# EAGLE design CANBUS_USB (EAGLE 9.1.3)
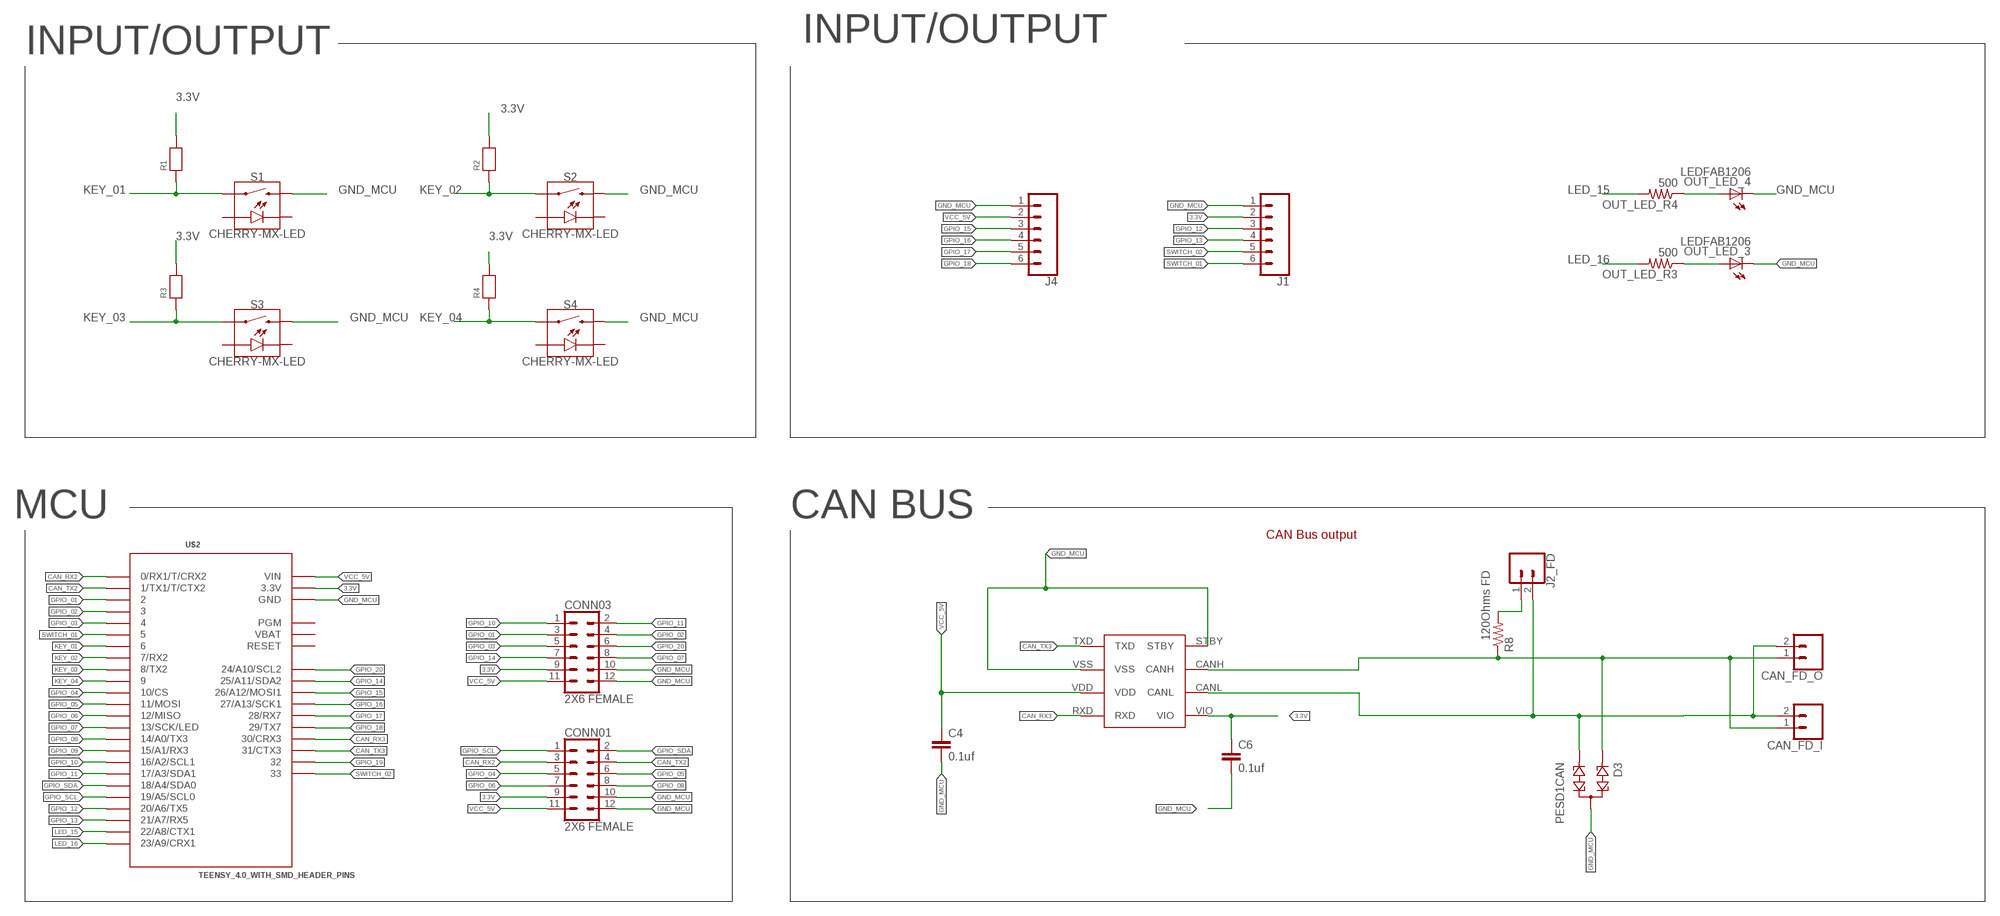
[diagram p0: schematic, sheet 1, part 1 of 2]
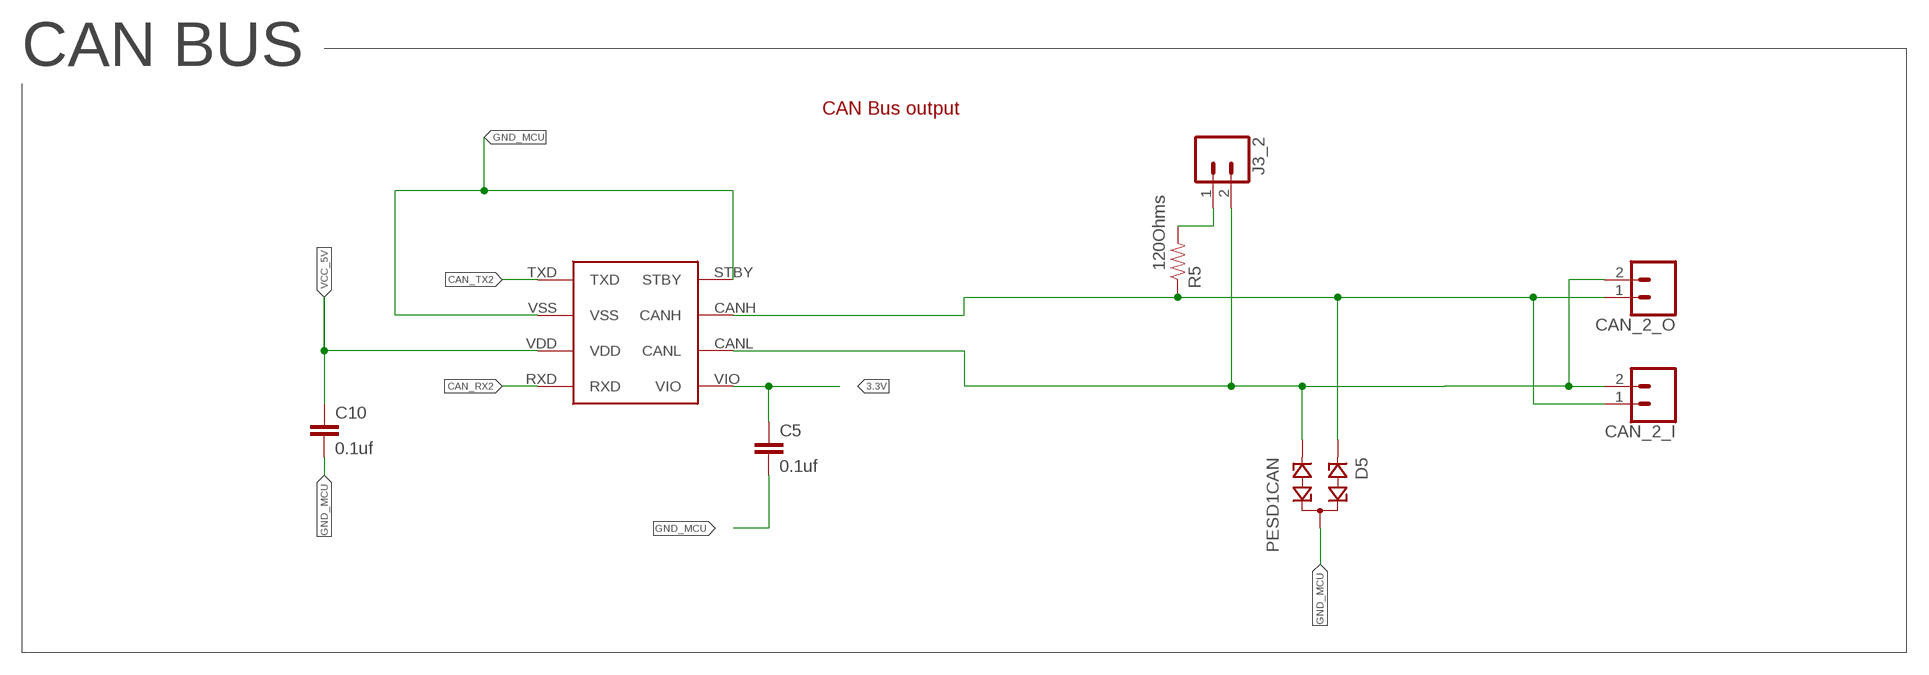
[diagram p1: schematic, sheet 1, part 2 of 2]

## Parts
C4  0.1uf  0.1UF-25V(+80/-20%)(0603)  [0603-CAP]
C5  0.1uf  0.1UF-25V(+80/-20%)(0603)  [0603-CAP]
C6  0.1uf  0.1UF-25V(+80/-20%)(0603)  [0603-CAP]
C10  0.1uf  0.1UF-25V(+80/-20%)(0603)  [0603-CAP]
CAN_2_I  CONN_02-JST-2MM-SMT  [JST-2-SMD]
CAN_2_O  CONN_02-JST-2MM-SMT  [JST-2-SMD]
CAN_FD_I  CONN_02-JST-2MM-SMT  [JST-2-SMD]
CAN_FD_O  CONN_02-JST-2MM-SMT  [JST-2-SMD]
CONN01  2X6 FEMALE  CONN_06X2PTH_FEMALE  [2X6]
CONN03  2X6 FEMALE  CONN_06X2PTH_FEMALE  [2X6]
D3  PESD1CAN  [SOT23]
D5  PESD1CAN  [SOT23]
J1  CONN_06SMD-1MM  [1X06-1MM]
J2_FD  CONN_02  [1X02]
J3_2  CONN_02  [1X02]
J4  CONN_06SMD-1MM  [1X06-1MM]
MCP2562  MCP2562  [MCP2562]
MCP2562FD  MCP2562  [MCP2562]
OUT_LED_3  LEDFAB1206  [LED1206FAB]
OUT_LED_4  LEDFAB1206  [LED1206FAB]
OUT_LED_R3  500  RES-US1206FAB  [R1206FAB]
OUT_LED_R4  500  RES-US1206FAB  [R1206FAB]
R1  RESISTOR1206  [1206]
R2  RESISTOR1206  [1206]
R3  RESISTOR1206  [1206]
R4  RESISTOR1206  [1206]
R5  120Ohms  10KOHM-1/10W-1%(0603)0603  [0603-RES]
R8  120Ohms FD  10KOHM-1/10W-1%(0603)0603  [0603-RES]
S1  CHERRY-MX-LED  [CHERRY-MX-LED]
S2  CHERRY-MX-LED  [CHERRY-MX-LED]
S3  CHERRY-MX-LED  [CHERRY-MX-LED]
S4  CHERRY-MX-LED  [CHERRY-MX-LED]
U$2  TEENSY_4.0_WITH_SMD_HEADER_PINS  [TEENSY_4.0_WITH_SMD_HEADER_PINS]

## Nets
3.3V: C5.1 C6.1 CONN01.9 CONN03.9 J1.2 MCP2562.VIO MCP2562FD.VIO R1.2 R2.2 R3.2 R4.2 U$2.3.3V U$2.3.3V1(3.3V)
CAN_H: CAN_FD_I.1 CAN_FD_O.1 D3.1 MCP2562FD.CANH R8.1
CAN_H1: CAN_2_I.1 CAN_2_O.1 D5.1 MCP2562.CANH R5.1
CAN_L: CAN_FD_I.2 CAN_FD_O.2 D3.2 J2_FD.2 MCP2562FD.CANL
CAN_L1: CAN_2_I.2 CAN_2_O.2 D5.2 J3_2.2 MCP2562.CANL
CAN_RX2: CONN01.3 MCP2562.RXD U$2.0(0/RX1/T/CRX2)
CAN_RX3: MCP2562FD.RXD U$2.30(30/CRX3)
CAN_TX2: CONN01.4 MCP2562.TXD U$2.1(1/TX1/T/CTX2)
CAN_TX3: MCP2562FD.TXD U$2.31(31/CTX3)
GND_MCU: C4.2 C5.2 C6.2 C10.2 CONN01.10 CONN01.12 CONN03.10 CONN03.12 D3.3 D5.3 J1.1 J4.1 MCP2562.STBY MCP2562.VSS MCP2562FD.STBY MCP2562FD.VSS OUT_LED_3.2(C) OUT_LED_4.2(C) S1.S2 S2.S2 S3.S2 S4.S2 U$2.GND U$2.GND1(GND) U$2.GND2(GND)
GPIO_01: CONN03.3 U$2.2
GPIO_02: CONN03.4 U$2.3
GPIO_03: CONN03.5 U$2.4
GPIO_04: CONN01.5 U$2.10(10/CS)
GPIO_05: CONN01.6 U$2.11(11/MOSI)
GPIO_06: CONN01.7 U$2.12(12/MISO)
GPIO_07: CONN03.8 U$2.13(13/SCK/LED)
GPIO_08: CONN01.8 U$2.14/A0(14/A0/TX3)
GPIO_09: U$2.15/A1(15/A1/RX3)
GPIO_10: CONN03.1 U$2.16/A2(16/A2/SCL1)
GPIO_11: CONN03.2 U$2.17/A3(17/A3/SDA1)
GPIO_12: J1.3 U$2.20/A6(20/A6/TX5)
GPIO_13: J1.4 U$2.21/A7(21/A7/RX5)
GPIO_14: CONN03.7 U$2.25(25/A11/SDA2)
GPIO_15: J4.3 U$2.26(26/A12/MOSI1)
GPIO_16: J4.4 U$2.27(27/A13/SCK1)
GPIO_17: J4.5 U$2.28(28/RX7)
GPIO_18: J4.6 U$2.29(29/TX7)
GPIO_19: U$2.32
GPIO_20: CONN03.6 U$2.24(24/A10/SCL2)
GPIO_SCL: CONN01.1 U$2.19/A5(19/A5/SCL0)
GPIO_SDA: CONN01.2 U$2.18/A4(18/A4/SDA0)
KEY_01: R1.1 S1.S1 U$2.6
KEY_02: R2.1 S2.S1 U$2.7(7/RX2)
KEY_03: R3.1 S3.S1 U$2.8(8/TX2)
KEY_04: R4.1 S4.S1 U$2.9
LED_15: OUT_LED_R4.2 U$2.22/A8(22/A8/CTX1)
LED_16: OUT_LED_R3.2 U$2.23/A9(23/A9/CRX1)
N$2: J2_FD.1 R8.2
N$5: J3_2.1 R5.2
N$6: OUT_LED_3.1(A) OUT_LED_R3.1
N$7: OUT_LED_4.1(A) OUT_LED_R4.1
SWITCH_01: J1.6 U$2.5
SWITCH_02: J1.5 U$2.33
VCC_5V [vcc5]: C4.1 C10.1 CONN01.11 CONN03.11 J4.2 MCP2562.VDD MCP2562FD.VDD U$2.VIN
Unconnected: S1.A S1.K(C) S2.A S2.K(C) S3.A S3.K(C) S4.A S4.K(C) U$2.PGM U$2.RESET

## Notes on the sheet
- INPUT/OUTPUT | INPUT/OUTPUT
- MCU | CAN BUS | CAN BUS
- CAN Bus output
- CAN Bus output

## Power pins joined to a net without a drawn wire
VBAT: U$2.VBAT

## Library data of the parts
C4-C6 C10 = SparkFun-Capacitors:0.1UF-25V(+80/-20%)(0603): CAP-00810 Ceramic Standard decoupling cap; PROD_ID: CAP-00810; VALUE: 0.1uF
CAN_2_I CAN_2_O CAN_FD_I CAN_FD_O = SparkFun-Connectors:CONN_02: Multi connection point. Often used as Generic Header-pin footprint for 0.1 inch spaced/style header connections On any of the 0.1 inch spaced packages, you can populate with these: Break Away Headers - Straight <https://www.sparkfun.com/products/116> (PRT-00116) Break Away Male Headers - Right Angle <https://www.sparkfun.com/products/553> (PRT-00553) Female Headers <https://www.sparkfun.com/products/115> (PRT-00115) Break Away Headers - Machine Pin <https://www.sparkfun.com/products/117> (PRT-00117) Break Away Female Headers - Swiss Machine Pin <https://www.sparkfun.com/products/743> (PRT-00743) For SCREWTERMINALS and SPRING TERMINALS visit here: Screw Terimnals on SparkFun.com <https://www.sparkfun.com/search/results?term=Screw+Terminals> (5mm/3.5mm/2.54mm spacing) This device is also useful as a general connection point to wire up your design to another part of your project. Our various solder wires solder well into these plated through hole pads. Hook-Up Wire - Assortment (Stranded, 22 AWG) <https://www.sparkfun.com/products/11375> (PRT-11375) Hook-Up Wire - Assortment (Solid Core, 22 AWG) <https://www.sparkfun.com/products/11367> (PRT-11367) View the entire wire category on our website here <https://www.sparkfun.com/categories/141> Special notes: Molex polarized connector foot print use with: PRT-08233 with associated crimp pins and housings. 2.54_SCREWTERM for use with PRT-10571. 3.5mm Screw Terminal footprints for PRT-08084 5mm Screw Terminal footprints for use with PRT-08432; PROD_ID: CONN-11443
CONN01 CONN03 = SparkFun-Connectors:CONN_06X2: Multi connection point. Often used as Generic Header-pin footprint for 0.1 inch spaced/style header connections On any of the 0.1 inch spaced packages, you can populate with these: Break Away Headers - Straight <https://www.sparkfun.com/products/116> (PRT-00116) Break Away Male Headers - Right Angle <https://www.sparkfun.com/products/553> (PRT-00553) Female Headers <https://www.sparkfun.com/products/115> (PRT-00115) Break Away Headers - Machine Pin <https://www.sparkfun.com/products/117> (PRT-00117) Break Away Female Headers - Swiss Machine Pin <https://www.sparkfun.com/products/743> (PRT-00743); PROD_ID: CONN-12423
D3 D5 = diode:PESD1CAN: CAN bus ESD protection diode Source: http://www.nxp.com/documents/data_sheet/PESD1CAN.pdf
J1 J4 = SparkFun-Connectors:CONN_06: Multi connection point. Often used as Generic Header-pin footprint for 0.1 inch spaced/style header connections On any of the 0.1 inch spaced packages, you can populate with these: Break Away Headers - Straight <https://www.sparkfun.com/products/116> (PRT-00116) Break Away Male Headers - Right Angle <https://www.sparkfun.com/products/553> (PRT-00553) Female Headers <https://www.sparkfun.com/products/115> (PRT-00115) Break Away Headers - Machine Pin <https://www.sparkfun.com/products/117> (PRT-00117) Break Away Female Headers - Swiss Machine Pin <https://www.sparkfun.com/products/743> (PRT-00743) Arduino Stackable Header - 6 Pin <https://www.sparkfun.com/products/9280> (PRT-09280) For SCREWTERMINALS and SPRING TERMINALS visit here: Screw Terimnals on SparkFun.com <https://www.sparkfun.com/search/results?term=Screw+Terminals> (5mm/3.5mm/2.54mm spacing) This device is also useful as a general connection point to wire up your design to another part of your project. Our various solder wires solder well into these plated through hole pads. Hook-Up Wire - Assortment (Stranded, 22 AWG) <https://www.sparkfun.com/products/11375> (PRT-11375) Hook-Up Wire - Assortment (Solid Core, 22 AWG) <https://www.sparkfun.com/products/11367> (PRT-11367) View the entire wire category on our website here <https://www.sparkfun.com/categories/141>; PROD_ID: CONN-08249; SF_ID: GPS-00579
J2_FD J3_2 = SparkFun-Connectors:CONN_02: Multi connection point. Often used as Generic Header-pin footprint for 0.1 inch spaced/style header connections On any of the 0.1 inch spaced packages, you can populate with these: Break Away Headers - Straight <https://www.sparkfun.com/products/116> (PRT-00116) Break Away Male Headers - Right Angle <https://www.sparkfun.com/products/553> (PRT-00553) Female Headers <https://www.sparkfun.com/products/115> (PRT-00115) Break Away Headers - Machine Pin <https://www.sparkfun.com/products/117> (PRT-00117) Break Away Female Headers - Swiss Machine Pin <https://www.sparkfun.com/products/743> (PRT-00743) For SCREWTERMINALS and SPRING TERMINALS visit here: Screw Terimnals on SparkFun.com <https://www.sparkfun.com/search/results?term=Screw+Terminals> (5mm/3.5mm/2.54mm spacing) This device is also useful as a general connection point to wire up your design to another part of your project. Our various solder wires solder well into these plated through hole pads. Hook-Up Wire - Assortment (Stranded, 22 AWG) <https://www.sparkfun.com/products/11375> (PRT-11375) Hook-Up Wire - Assortment (Solid Core, 22 AWG) <https://www.sparkfun.com/products/11367> (PRT-11367) View the entire wire category on our website here <https://www.sparkfun.com/categories/141> Special notes: Molex polarized connector foot print use with: PRT-08233 with associated crimp pins and housings. 2.54_SCREWTERM for use with PRT-10571. 3.5mm Screw Terminal footprints for PRT-08084 5mm Screw Terminal footprints for use with PRT-08432
MCP2562 MCP2562FD = MCP2562:MCP2562
OUT_LED_3 OUT_LED_4 = fab:LED: LED
OUT_LED_R3 OUT_LED_R4 = fab:RES-US: Resistor (US Symbol) Variants with postfix FAB are widened to allow the routing of internal traces
R1-R4 = microbuilder:RESISTOR: Resistors 0402 - 0402 Surface Mount Package 22 Ohm 1% 1/16W [Digikey: 311-22.0LRTR-ND] 33 Ohm 5% 1/16W 1.0K 5% 1/16W 1.5K 5% 1/16W 2.0K 1% 1/16W 10.0K 1% 1/16W [Digikey: 311-10.0KLRTR-ND] 10.0K 5% 1/16W [Digikey: RMCF0402JT10K0TR-ND] 12.1K 1% 1/16W [Digikey: 311-22.0LRTR-ND] 100.0K 5% 1/16W 0603 - 0603 Surface Mount Package 0 Ohm 1/10 Watt 1% Resistor 15 Ohm 1/10 Watt 1% Resistor 33 Ohm 1/10 Watt 1% Resistor 49.9 Ohm 1/10 Watt 1% Resistor 100 Ohm 1/10 Watt 1% Resistor 150 Ohm 1/10 Watt 1% Resistor 240 Ohm 1/10 Watt 1% Resistor 390 Ohm 1/10 Watt 1% Resistor 560 Ohm 1/10 Watt 1% Resistor 680 Ohm 1/10 Watt 1% Resistor 750 Ohm 1/10 Watt 1% Resistor 1.0K Ohm 1/10 Watt 1% Resistor 1.5K Ohm 1/10 Watt 1% Resistor 2.0K Ohm 1/10 Watt 1% Resistor 2.2K Ohm 1/10 Watt 1% Resistor 3.3K Ohm 1/10 Watt 1% Resistor 4.7K Ohm 1/10 Watt 1% Resistor 10.0K Ohm 1/10 Watt 1% Resistor 12.0K Ohm 1/10 Watt 1% Resistor 12.1K Ohm 1/10 Watt 1% Resistor 20.0K Ohm 1/10 Watt 1% Resistor 33.0K Ohm 1/10 Watt 1% Resistor 100.0K Ohm 1/10 Watt 1% Resistor 0805 - 0805 Surface Mount Package 0 Ohm 1/8 Watt 1% Resistor 33 Ohm 1/8 Watt 1% Resistor 100 Ohm 1/8 Watt 1% Resistor 150 Ohm 1/8 Watt 1% Resistor 200 Ohm 1/8 Watt 1% Resistor 240 Ohm 1/8 Watt 1% Resistor 330 Ohm 1/8 Watt 1% Resistor 390 Ohm 1/8 Watt 1% Resistor 470 Ohm 1/8 Watt 1% Resistor 1.0K Ohm 1/8 Watt 1% Resistor 1.5K Ohm 1/8 Watt 1% Resistor 2.0K Ohm 1/8 Watt 1% Resistor 4.7K Ohm 1/8 Watt 1% Resistor 5.1K Ohm 1/8 Watt 1% Resistor 5.6K Ohm 1/8 Watt 1% Resistor 10.0K Ohm 1/8 Watt 1% Resistor 22.0K Ohm 1/8 Watt 1% Resistor 33.0K Ohm 1/8 Watt 1% Resistor 100K Ohm 1/8 Watt 1% Resistor 1206 - 1206 Surface Mount Package 2012 - 2010 Surface Mount Package 0.11 Ohm 1/2 Watt 1% Resistor - Digikey: RHM.11UCT-ND
R5 R8 = SparkFun-Resistors:10KOHM-1/10W-1%(0603): RES-00824; PROD_ID: RES-00824; VALUE: 10K
S1-S4 = cherry-temp:CHERRY-MX-LED
U$2 = Teensy4:TEENSY_4.0_WITH_SMD_HEADER_PINS: Footprint for Teensy 3.1 or 3.2 board using all pin connections on the outer perimeter

## Net classes
0 default: width 0.2 mm, clearance 0.2 mm
1 gnd: width 0.2 mm, clearance 0.2 mm
3 vcc: width 0.35 mm, clearance 0.2 mm
4 vcc5: width 0.35 mm, clearance 0.2 mm

## Board
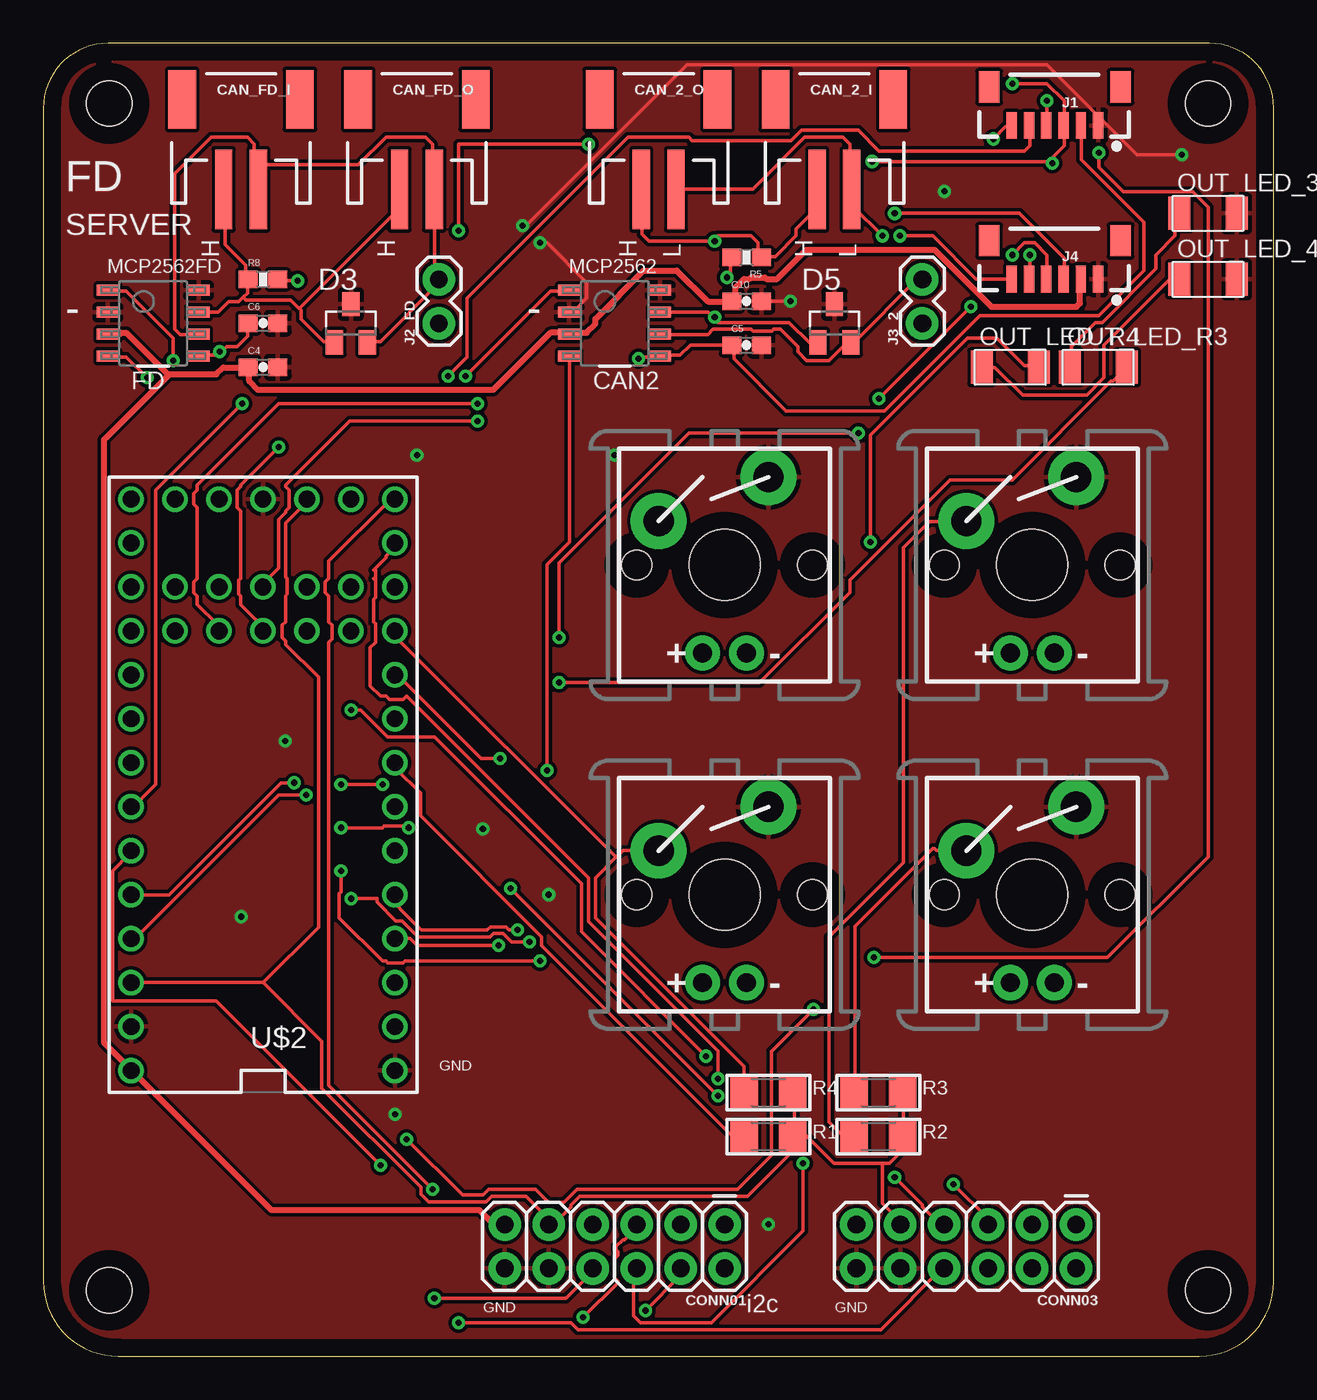
[diagram p2: board, top side]
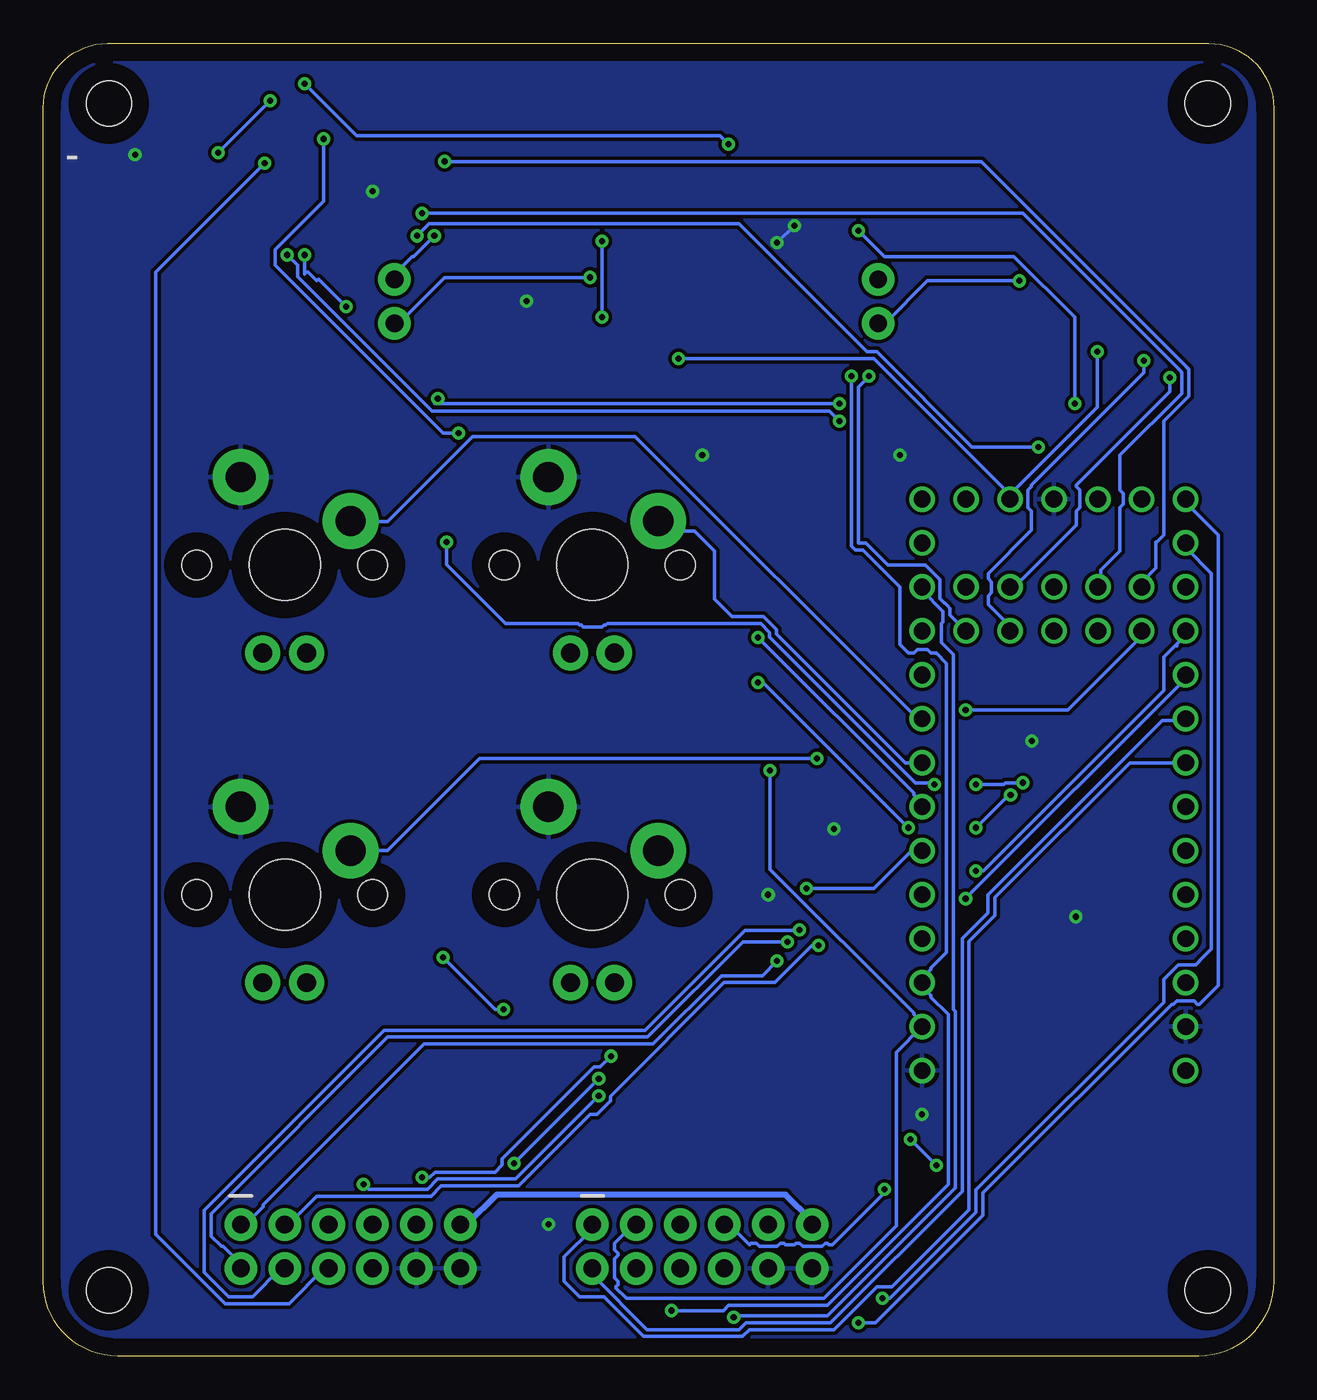
[diagram p3: board, bottom side, seen from below]

Size 71.1 x 75.87 mm. Coordinates in mm from the lower left corner, seen from the top.
Outline: 0,72.12 0,4.34 arc90 4.34,0 66.8,0 arc90 71.1,4.3 71.1,72.15 arc90 67.38,75.87 3.75,75.87 arc90 0,72.12
Copper layers (1*16): Top 0.035mm / dielectric 1.5mm / Bottom 0.035mm
Design rules "default": minimum track width 6mil, minimum drill 0.35mm, track to track 6mil, track to pad 6mil, pad to pad 6mil, via to via 6mil, smd to smd 6mil, copper to edge 40mil, drill to drill 6mil, minimum pad ring 10mil, minimum via ring 8mil, stop-mask expansion 4mil, vias tented up to drill 0mil, thermal gap 10mil
Holes 2.6 mm at 3.81,72.39 67.31,72.39 3.81,3.81 67.31,3.81

### Footprints (pad centres in the part's own frame; a part is rotated, then mirrored left to right if it is on the bottom)
0603-CAP = smd 1.1 x 1: 1 -0.85,0; 2 0.85,0
JST-2-SMD = smd 1 x 4.6: 1 -1,-3.7; 2 1,-3.7 | smd 1.6 x 3.4: NC1 -3.4,1.5; NC2 3.4,1.5
2X6 = drill 1.016 pad 1.88: 1 0,0; 2 0,2.54; 3 2.54,0; 4 2.54,2.54; 5 5.08,0; 6 5.08,2.54; 7 7.62,0; 8 7.62,2.54; 9 10.16,0; 10 10.16,2.54; 11 12.7,0; 12 12.7,2.54
SOT23 = smd 1 x 1.4: 1 -0.95,-1.1; 2 0.95,-1.1; 3 0,1.1
1X06-1MM = smd 0.6 x 1.55: 1 -2.54,1.27; 2 -1.54,1.27; 3 -0.54,1.27; 4 0.46,1.27; 5 1.46,1.27; 6 2.46,1.27 | smd 1.2 x 1.8: P$1 -3.84,-0.955; P$2 3.76,-0.955
1X02 = drill 1.016 pad 1.88: 1 0,0; 2 2.54,0
MCP2562 = smd 1.27 x 0.635: CANH 2.625,0.635; CANL 2.625,-0.635; RXD -2.625,-1.905; STBY 2.625,1.905; TXD -2.625,1.905; VDD -2.625,-0.635; VIO 2.625,-1.905; VSS -2.625,0.635
LED1206FAB = smd 1.27 x 1.905: 1 -1.651,0; 2 1.651,0
R1206FAB = smd 1.27 x 1.905: 1 -1.651,0; 2 1.651,0
1206 = smd 1.6 x 1.8: 1 -1.4,0; 2 1.4,0
0603-RES = smd 1.1 x 1: 1 -0.85,0; 2 0.85,0
CHERRY-MX-LED = drill 1.092 pad 2.032: A -1.27,-5.08; K 1.27,-5.08 | drill 1.753 pad 3.226: S1 -3.81,2.54; S2 2.54,5.08 | hole 4.089: 0,0 | hole 1.707: -5.08,0; 5.08,0
TEENSY_4.0_WITH_SMD_HEADER_PINS = drill 0.965: 0 -7.62,13.97; 1 -7.62,11.43; 2 -7.62,8.89; 3 -7.62,6.35; 3.3V 7.62,11.43; 3.3V1 -2.54,-16.51; 4 -7.62,3.81; 5 -7.62,1.27; 6 -7.62,-1.27; 7 -7.62,-3.81; 8 -7.62,-6.35; 9 -7.62,-8.89; 10 -7.62,-11.43; 11 -7.62,-13.97; 12 -7.62,-16.51; 13 7.62,-16.51; 14/A0 7.62,-13.97; 15/A1 7.62,-11.43; 16/A2 7.62,-8.89; 17/A3 7.62,-6.35; 18/A4 7.62,-3.81; 19/A5 7.62,-1.27; 20/A6 7.62,1.27; 21/A7 7.62,3.81; 22/A8 7.62,6.35; 23/A9 7.62,8.89; 24 5.08,-11.43; 25 5.08,-8.89; 26 2.54,-11.43; 27 2.54,-8.89; 28 0,-11.43; 29 0,-8.89; 30 -2.54,-11.43; 31 -2.54,-8.89; 32 -5.08,-11.43; 33 -5.08,-8.89; GND -7.62,16.51; GND1 0,-16.51; GND2 7.62,13.97; PGM 2.54,-16.51; RESET 5.08,-16.51; VBAT -5.08,-16.51; VIN 7.62,16.51

### Placement (x,y rotation side)
C4  12.7,57.15 0 top
C5  40.64,58.42 0 top
C6  12.7,59.69 0 top
C10  40.64,60.96 0 top
CAN_2_I  45.72,71.12 0 top
CAN_2_O  35.56,71.12 0 top
CAN_FD_I  11.43,71.12 0 top
CAN_FD_O  21.59,71.12 0 top
CONN01  39.37,7.62 180 top
CONN03  59.69,7.62 180 top
D3  17.78,59.69 0 top
D5  45.72,59.69 0 top
J1  58.42,72.39 180 top
J2_FD  22.86,59.69 90 top
J3_2  50.8,59.69 90 top
J4  58.42,63.5 180 top
MCP2562  33.02,59.69 0 top
MCP2562FD  6.35,59.69 0 top
OUT_LED_3  67.31,66.04 0 top
OUT_LED_4  67.31,62.23 0 top
OUT_LED_R3  60.96,57.15 0 top
OUT_LED_R4  55.88,57.15 0 top
R1  41.91,12.7 0 top
R2  48.26,12.7 0 top
R3  48.26,15.24 0 top
R4  41.91,15.24 0 top
R5  40.64,63.5 180 top
R8  12.7,62.23 0 top
S1  39.37,45.72 0 top
S2  57.15,45.72 0 top
S3  57.15,26.67 0 top
S4  39.37,26.67 0 top
U$2  12.7,33.02 180 top

### Tracks (layer width: path | path; a pad name or v marks a point on that pad's centre or on a via)
3.3V  (via drill 0.35)
  Top 0.2: R1.2 43.4,12.74 43.4,15.24 R4.2 | R3.2 49.7,15.24 49.7,12.74 R2.2 49.6,12.64 49.6,11.84 48.9,11.14 48.5,11.14 | 48.5,11.14 45.7,11.14 44.1,12.74 43.5,12.74 R1.2 | 48.5,11.14 48.5,8.84 49.5,7.84 49.5,7.64 CONN03.9 | 5.4,21.54 5.1,21.54 U$2.3.3V | R1.2 43.3,12.64 43.3,11.84 40.7,9.24 31,9.24 30.5,8.74 30.5,8.64 29.9,8.04 29.2,8.04 CONN01.9 29.2,7.64 29.2,7.94 27.9,9.24 25.9,9.24 25.57,8.91 22.27,8.91 21.82,9.36 21.82,9.75 16.1,15.47 16.1,18.19 12.7,21.59 | 10.25,57.99 10.1,57.84 9,57.84 MCP2562FD.VIO | 10.25,57.99 10.6,58.34 11.2,58.34 11.8,58.94 11.8,59.64 C6.1 | v10.2,58.04 10.25,57.99 | J1.2 60,71.04 60,69.14 63.6,65.54 63.6,62.74 61,60.14 54.13,60.14 48.6,54.61 42.93,54.61 39.9,57.64 39.9,58.24 39.8,58.34 C5.1 39.7,58.44 37.4,58.44 36.8,57.84 35.7,57.84 MCP2562.VIO 35.6,57.74 34.5,57.74 v34.4,57.64 | 5.5,21.74 5.5,21.54 U$2.3.3V | 15.9,32.14 15.9,39.24 14,41.14 14,41.34 13.8,41.54 13.8,42.24 14,42.44 14,43.94 14.1,44.04 14.1,44.94 14,45.04 14,48.14 15.3,49.44 U$2.3.3V1 | U$2.3.3V 12.7,21.59 | 15.9,32.14 | 15.9,32.14 15.9,24.79 12.7,21.59
  Bottom 0.2: v10.2,58.04 10.2,54.84 15.2,49.84 15.2,49.54 U$2.3.3V1 15.2,49.94 15.4,49.94 23.1,57.64 v34.4,57.64
CAN_H
  Top 0.2: 11.55,61.19 11.3,60.94 10.7,60.94 10.1,60.34 9,60.34 MCP2562FD.CANH | 11.55,61.19 11.8,61.44 11.8,62.14 R8.1 11.7,62.14 11.7,63.04 10.5,64.24 10.5,67.34 CAN_FD_I.1 | 14.8,60.54 14.3,61.04 11.7,61.04 11.6,61.14 11.55,61.19 | 14.8,60.54 14.9,60.44 14.9,59.94 16.2,58.64 16.8,58.64 D3.1 | 14.8,60.54 20.5,66.24 20.5,67.34 CAN_FD_O.1
CAN_H1  (via drill 0.35)
  Top 0.2: 38.75,59.99 39,59.74 43.1,59.74 44.3,58.54 44.7,58.54 D5.1 | 38.75,59.99 38.4,60.34 35.7,60.34 MCP2562.CANH | CAN_2_I.1 44.7,67.34 44.7,66.34 43.5,65.14 43.5,64.74 42.3,63.54 41.5,63.54 R5.1 41.5,63.64 41.3,63.84 41.3,64.34 40.9,64.74 39,64.74 38.75,64.49 | 38.75,64.49 38.7,64.44 35,64.44 34.6,64.84 34.6,67.34 CAN_2_O.1 | v38.8,60.04 38.75,59.99 | v38.8,64.44 38.75,64.49
  Bottom 0.2: v38.8,64.44 v38.8,60.04
CAN_L
  Top 0.2: 12.2,68.84 12.2,67.64 12.4,67.44 CAN_FD_I.2 12.2,68.84 | 12.2,68.84 12.2,70.04 11.8,70.44 9.7,70.44 7.6,68.34 7.6,59.34 7.9,59.04 8.9,59.04 MCP2562FD.CANL | D3.2 18.8,58.64 19.5,58.64 22.8,61.94 22.8,62.14 J2_FD.2 22.8,62.24 22.8,62.94 22.6,63.14 22.6,67.34 CAN_FD_O.2 22.5,67.44 22.5,70.04 22.1,70.44 19.8,70.44 18.2,68.84 12.2,68.84
CAN_L1  (via drill 0.35)
  Top 0.2: CAN_2_O.2 36.6,67.44 41,67.44 44,70.44 46.2,70.44 46.6,70.04 46.6,67.54 46.7,67.44 CAN_2_I.2 46.8,67.34 46.8,66.44 v48.5,64.74 | MCP2562.CANL 35.7,59.04 38.4,59.04 38.7,59.34 40.9,59.34 41,59.24 42.1,59.24 42.2,59.34 42.6,59.34 43.6,58.34 43.6,58.04 44.1,57.54 45.4,57.54 46.4,58.54 46.6,58.54 D5.2 46.7,58.64 46.9,58.64 50.4,62.14 50.8,62.14 J3_2.2
  Bottom 0.2: v48.5,64.74 49.7,63.54 49.8,63.54 50.8,62.54 J3_2.2
CAN_RX2  (via drill 0.35)
  Top 0.2: v29.1,33.84 29.1,45.74 30.4,47.04 30.4,57.74 MCP2562.RXD
  Bottom 0.2: v29.1,33.84 29.1,28.14 20.8,19.84 20.8,19.74 20.4,19.34 20.4,19.14 U$2.0 | 20.4,18.74 20.4,19.04 U$2.0 | CONN01.3 36.9,7.54 37.1,7.54 38.1,6.54 38.1,6.14 37.9,5.94 37.9,5.84 38.1,5.64 38.1,4.54 37.9,4.34 37.9,4.14 38,4.04 38,3.94 37.4,3.34 26,3.34 21.8,7.54 21.8,17.57 U$2.0
CAN_RX3  (via drill 0.35)
  Top 0.2: v6,56.54 4.8,57.74 3.8,57.74 MCP2562FD.RXD
  Bottom 0.2: v6,56.54 6,55.74 11.4,50.34 11.4,50.24 11.2,50.04 11.2,49.04 11.4,48.84 11.4,48.04 14.9,44.54 15.2,44.54 U$2.30
CAN_TX2  (via drill 0.35)
  Top 0.2: v24.4,56.64 29.3,61.54 30.3,61.54 MCP2562.TXD | v34.8,2.64 36.8,4.64 36.8,5.04 CONN01.4
  Bottom 0.2: v34.8,2.64 31.8,2.64 31.5,2.94 25.8,2.94 18.8,9.94 18.8,19.74 19.8,20.74 19.8,20.84 20.3,21.34 20.3,21.54 U$2.1 20.3,21.64 20.3,21.84 19.8,22.34 19.8,22.44 18.9,23.34 18.9,40.04 19.5,40.64 19.8,40.64 20,40.84 20.6,40.84 20.8,40.64 21.1,40.64 21.59,41.13 21.59,44.45 23.73,46.59 24.17,46.59 24.4,46.82 v24.4,56.64
CAN_TX3  (via drill 0.35)
  Top 0.2: v7.5,57.54 7.5,58.84 4.8,61.54 3.8,61.54 MCP2562FD.TXD
  Bottom 0.2: v7.5,57.54 7.5,56.84 14,50.34 14,50.24 14.2,50.04 14.2,49.04 14,48.84 14,47.74 16.5,45.24 16.5,44.94 16.3,44.74 16.3,44.14 16.5,43.94 16.5,43.44 15.3,42.24 15.3,41.94 U$2.31
GND_MCU  (via drill 0.35)
  Top 0.2: v65.8,69.44 63.2,69.44 58,74.64 37.2,74.64 27.9,65.34 v27.7,65.34 | v28.7,64.34 29.1,64.34 31.4,62.04 31.4,61.14 30.6,60.34 30.4,60.34 MCP2562.VSS | 61,62.24 J4.1 61,62.24 | 61,62.24 61.03,62.24 61,62.24 | C10.2 v43.18,60.96
  Bottom 0.2: v28.7,64.34 v27.7,65.34
  other vias: 11.43,25.4 13.97,35.56 29.21,26.67 21.59,52.07 25.4,30.48 52.07,67.31 33.02,52.07 20.32,13.97 41.91,7.62
  pour Top: -58.42,80.01 119.38,80.01 119.38,-6.35 -58.42,-6.35
  pour Bottom: -43.92,83.82 132.61,83.82 132.61,-92.71 arc-90
GPIO_01  (via drill 0.35)
  Top 0.2: v26.3,23.74 21.6,23.74 21.2,24.14 20.4,24.14 U$2.2
  Bottom 0.2: v26.3,23.74 26.67,23.74 28.82,21.59 31.75,21.59 38.32,15.02 38.32,14.76 39.11,13.97 39.5,13.97 43.63,9.84 48.1,9.84 48.7,9.24 55.3,9.24 56.9,7.64 57.1,7.64 CONN03.3
GPIO_02  (via drill 0.35)
  Top 0.2: 20.4,26.64 U$2.3 20.32,26.15 20.91,25.57 21.76,24.72 21.76,24.71 21.85,24.62 25.66,24.62 25.85,24.82 26.75,24.82 26.93,24.64 v27.4,24.64
  Bottom 0.2: CONN03.4 57.2,5.04 57.4,5.04 59,3.44 60.4,3.44 61.8,4.84 61.8,8.44 51.4,18.84 36.34,18.84 30.56,24.62 27.42,24.62 v27.4,24.64
GPIO_03  (via drill 0.35)
  Top 0.2: v39,15.04 v27,27.04 | v52.6,9.94 54.6,7.94 54.6,7.64 CONN03.5
  Bottom 0.2: v27,27.04 23.1,27.04 21,29.14 20.4,29.14 U$2.4 | v39,15.04 43.8,10.24 48.3,10.24 48.9,9.64 52.3,9.64 v52.6,9.94
GPIO_04  (via drill 0.35)
  Top 0.2: v31.2,2.24 33.2,4.24 33.2,4.34 33,4.54 33,5.64 33.2,5.84 33.2,6.04 33.1,6.14 33.1,6.34 33.5,6.74 33.6,6.74 34.2,7.34 34.2,7.54 CONN01.5
  Bottom 0.2: v31.2,2.24 31.1,2.34 25.8,2.34 18.4,9.74 18.4,19.94 18.5,20.04 18.5,40.54 19.2,41.24 19.2,42.34 19.1,42.44 19.1,43.04 20.3,44.24 20.3,44.44 U$2.10
GPIO_05  (via drill 0.35)
  Top 0.2: 19.1,45.44 19.15,45.49 | 19.15,45.49 19.8,46.14 19.8,46.24 20.3,46.74 20.3,46.94 U$2.11 | 19.15,44.89 19.2,44.84 19.2,43.84 19.1,43.74 19.1,42.44 19.2,42.34 19.2,41.24 18.9,40.94 18.9,38.74 19.5,38.14 19.8,38.14 20,37.94 20.8,37.94 21,38.14 31.5,27.64 31.5,25.14 39,17.64 v39,16.04 | 19.15,44.89 19.1,44.94 | v43.9,11.14 43.9,7.24 38.6,1.94 34.5,1.94 34.1,2.34 34.1,4.14 34.2,4.24 34.2,5.04 CONN01.6 | 19.15,45.49 19.2,45.44 19.2,44.94 19.15,44.89
  Bottom 0.2: v43.9,11.14 v39,16.04
GPIO_06  (via drill 0.35)
  Top 0.2: v22.5,9.64 16.5,15.64 16.5,41.24 16.7,41.44 16.7,42.24 16.5,42.44 16.5,43.94 16.3,44.14 16.3,44.74 16.5,44.94 16.5,45.94 20,49.44 20.3,49.44 U$2.12
  Bottom 0.2: v22.5,9.64 22.5,9.44 25.5,6.44 25.7,6.44 25.8,6.54 25.9,6.54 26.1,6.34 27.2,6.34 27.4,6.54 27.6,6.54 27.7,6.44 28.2,6.44 28.3,6.54 28.5,6.54 28.7,6.34 29.7,6.34 29.9,6.54 30.2,6.54 30.3,6.44 31.4,7.54 31.7,7.54 CONN01.7
GPIO_07  (via drill 0.35)
  Top 0.2: v24,1.94 30.5,1.94 30.9,1.54 48.4,1.54 52,5.14 CONN03.8
  Bottom 0.2: v24,1.94 23,1.94 16.8,8.14 16.8,9.44 5.9,20.34 5.8,20.34 5.6,20.54 4.6,20.54 4.4,20.34 4.3,20.34 3.2,21.44 3.2,47.44 5,49.24 5,49.44 U$2.13
GPIO_08  (via drill 0.35)
  Top 0.2: v22.6,3.34 30.2,3.34 31.7,4.84 31.7,5.04 CONN01.8
  Bottom 0.2: 4.3,22.84 4.04,23.09 | 4.04,23.09 3.6,23.54 3.6,45.24 5,46.64 5,46.94 U$2.14/A0 | 4.04,23.09 4.51,22.63 5.51,22.63 6.35,21.79 6.35,20.46 17.2,9.61 17.2,8.31 22.17,3.34 v22.6,3.34
GPIO_10  (via drill 0.35)
  Top 0.2: v17.2,28.04 17.2,26.84 17.1,26.74 17.1,25.34 19.6,22.84 19.8,22.84 19.9,22.74 20.8,22.74 20.9,22.84 v28.7,22.84
  Bottom 0.2: 5.59,41.15 5.6,41.14 5.6,41.04 | 5.59,41.15 5.1,41.64 5.1,41.84 U$2.16/A2 | 38.1,18.04 49.1,18.04 58.4,8.74 58.4,8.64 59.4,7.64 59.6,7.64 CONN03.1 | 38.1,18.04 38,18.04 | 5.59,41.15 6.35,40.39 6.35,38.46 16.77,28.04 v17.2,28.04 | 38.1,18.04 35.87,18.04 31.92,21.99 29.55,21.99 v28.7,22.84
GPIO_11  (via drill 0.35)
  Top 0.2: v17.8,26.44 19.28,26.44 19.28,26.24 20.36,25.17 20.75,25.17 21.36,24.56 21.36,24.55 21.68,24.22 25.82,24.22 26.02,24.42 26.58,24.42 27.06,23.94 v28.1,23.94
  Bottom 0.2: v17.8,26.44 5.1,39.14 5.1,39.34 U$2.17/A3 | CONN03.2 59.7,5.14 59.7,5.34 60.7,6.34 60.8,6.34 61.4,6.94 61.4,8.24 51.2,18.44 36.17,18.44 30.67,23.94 v28.1,23.94
GPIO_12  (via drill 0.35)
  Top 0.2: v56,73.54 58,73.54 59,72.54 59,71.54 J1.3 | v31.5,70.04 24,70.04 v24,65.04 | v11.5,55.04 6.5,50.04 6.5,33.04 5.5,32.04 U$2.20/A6
  Bottom 0.2: v56,73.54 53,70.54 32,70.54 v31.5,70.04 | v24,65.04 22.5,63.54 15,63.54 11.5,60.04 v11.5,55.04
GPIO_13  (via drill 0.35)
  Top 0.2: v58,72.54 58,71.54 J1.4 | v48,23.04 61.5,23.04 67.31,28.85 67.31,66.4 66.42,67.29 62.41,67.29 61,68.71 v61,69.54 | v44.5,20.04 42.08,17.61 42.08,11.59 40.12,9.64 30.83,9.64 30.08,8.89 29.21,8.89 28.46,9.64 25.73,9.64 25.41,9.32 24.23,9.32 v21,12.54 | v19.5,11.04 10,20.54 4,20.54 4,28.04 5,29.04 U$2.21/A7
  Bottom 0.2: v61,69.54 v58,72.54 | v48,23.04 45,20.04 v44.5,20.04 | v19.5,11.04 v21,12.54
GPIO_14  (via drill 0.35)
  Top 0.2: 31.1,25.4 31.1,24.54 v38.3,17.34 | 31.1,25.4 31.1,25.54 | v49.2,10.34 50.8,8.74 50.8,8.64 51.8,7.64 52,7.64 CONN03.7 | v17.8,37.34 18.34,37.34 19.89,35.79 22.63,35.79 31.1,27.32 31.1,25.4
  Bottom 0.2: v17.8,37.34 11.9,37.34 7.7,41.54 7.7,41.84 U$2.25 | v49.2,10.34 48.77,10.34 48.47,10.64 45,10.64 44.58,11.06 44.58,11.42 39.28,16.72 38.92,16.72 v38.3,17.34
GPIO_15  (via drill 0.35)
  Top 0.2: v49.2,66.04 56.4,66.04 59,63.44 59,62.24 J4.3
  Bottom 0.2: v49.2,66.04 14.5,66.04 5.34,56.88 | 5.3,56.84 5.34,56.88 | U$2.26 10.1,44.54 10,44.64 10,45.44 8.9,46.54 8.9,49.04 8.7,49.24 8.7,49.84 8.9,50.04 8.9,52.06 5.32,55.64 5.32,56.82 5.34,56.84 | 5.34,56.88 5.34,56.84 | 5.34,56.84 5.3,56.8 | 5.34,56.88 5.34,56.84
GPIO_16  (via drill 0.35)
  Top 0.2: v56,63.64 56.7,64.34 57.3,64.34 58,63.64 58,62.24 J4.4 | v25.1,55.04 13.6,55.04 8.9,50.34 8.9,50.04 8.7,49.84 8.7,49.24 8.9,49.04 8.9,44.94 8.7,44.74 8.7,44.14 8.9,43.94 8.9,43.44 10.1,42.24 10.1,41.94 U$2.27 | v48.3,55.34 v53.6,60.64
  Bottom 0.2: 56,62.54 56,62.64 | 56,62.64 v56,63.64 | v25.1,55.04 48.3,55.04 | 48.3,55.04 48.5,55.04 | 56,62.64 55.8,62.64 55.3,62.14 55.2,62.24 v53.6,60.64 | 48.3,55.04 v48.3,55.34
GPIO_17  (via drill 0.35)
  Top 0.2: v57,63.64 57,62.24 J4.5 | v25.1,54.04 17.7,54.04 14,50.34 14,50.24 14.2,50.04 14.2,49.04 14,48.84 14,48.74 13.6,48.34 13.6,45.54 12.7,44.64 12.7,44.54 U$2.28
  Bottom 0.2: v25.1,54.04 25.67,54.61 48.64,54.61 56.4,62.37 56.4,63.04 v57,63.64
GPIO_18  (via drill 0.35)
  Top 0.2: v49.5,64.74 51.4,64.74 53.9,62.24 55.9,62.24 J4.6 | v13.6,52.54 11.4,50.34 11.4,50.24 11.2,50.04 11.2,49.04 11.4,48.84 11.4,44.94 11.3,44.84 11.3,44.04 11.4,43.94 11.4,43.44 12.7,42.14 12.7,41.94 U$2.29
  Bottom 0.2: v49.5,64.74 48.8,65.44 30.9,65.44 30.36,64.89 23.5,58.04 22.93,58.04 17.43,52.54 v13.6,52.54
GPIO_20  (via drill 0.35)
  Top 0.2: 59,71.04 59,69.94 58.15,69.09 | 58.15,69.09 58.1,69.04 v47.9,69.04 | v58.3,68.94 58.2,69.04 58.15,69.09
  Bottom 0.2: v47.9,69.04 16.9,69.04 5.04,57.19 | 4.9,57.04 5.04,57.19 | 6.8,46.99 6.8,45.54 7.6,44.74 7.6,44.54 U$2.24 | 6.8,46.99 6.8,47.04 | v58.3,68.94 64.6,62.64 64.6,7.04 60.6,3.04 56.9,3.04 54.9,5.04 54.7,5.04 CONN03.6 | 5.04,57.19 5.04,57.15 4.9,57.01 4.9,55.49 6.35,54.04 6.35,49.53 | 6.35,49.53 6.35,48.89 | 6.35,49.53 6.35,47.44 6.8,46.99
GPIO_SCL
  Bottom 0.2: 5.1,34.24 U$2.19/A5 8.32,34.29 16.11,26.5 16.11,25.46 17.6,23.97 17.6,8.47 22.05,4.02 22.92,4.02 25.4,1.54 30.3,1.54 30.7,1.14 36.4,1.14 38.7,3.44 40.1,3.44 41,4.34 41,5.74 39.4,7.34 39.4,7.54 CONN01.1
GPIO_SDA
  Bottom 0.2: U$2.18/A4 5.1,36.74 6.44,36.74 16.51,26.67 16.51,25.63 18,24.14 18,9.54 25.6,1.94 30.5,1.94 30.9,1.54 36.2,1.54 39.3,4.64 39.3,5.04 CONN01.2
KEY_01
  Top 0.2: R1.1 40.5,12.74 39.8,12.74 28.8,23.74 28.8,24.24 21.8,31.24 21.8,32.54 20.4,33.94 20.4,34.24 U$2.6
  Bottom 0.2: 35.5,48.24 S1.S1 34.99,47.69 33.47,47.69 32.32,46.54 32.32,43.75 31.31,42.74 29.48,42.74 28.72,41.99 28.72,41.73 21.28,34.29 U$2.6
KEY_02
  Top 0.2: R2.1 46.8,12.74 46.2,12.74 45.4,13.54 45.4,24.24 49.7,28.54 49.7,46.74 51.2,48.24 53.3,48.24 S2.S1
  Bottom 0.2: U$2.7 20.4,36.84 20.6,36.84 36.9,53.14 46.3,53.14 51.2,48.24 53.3,48.24 S2.S1
KEY_03  (via drill 0.35)
  Top 0.2: R3.1 46.9,15.24 46.9,24.84 51.4,29.34 51.5,29.34 51.6,29.24 53.3,29.24 S3.S1 | v26.4,34.54 25.3,34.54 20.8,39.04 20.7,39.04 20.4,39.34 U$2.8
  Bottom 0.2: v26.4,34.54 45.9,34.54 51.2,29.24 53.3,29.24 S3.S1
KEY_04
  Top 0.2: 33.1,28.84 33.5,29.24 35.5,29.24 S4.S1 | 33.1,28.84 31.9,27.64 31.9,25.34 40.5,16.74 R4.1 | 33.1,28.84 20.4,41.54 20.4,41.84 U$2.9
LED_15  (via drill 0.35)
  Top 0.2: v47.8,47.04 47.8,53.24 53.4,58.84 55.1,58.84 56.7,57.24 57.5,57.24 OUT_LED_R4.2 | v17.2,33.04 v19.6,33.04 | 5.4,26.74 5.1,26.74 U$2.22/A8 7.26,26.67 13.73,33.14 v14.5,33.14
  Bottom 0.2: v47.8,47.04 47.8,45.74 44.4,42.34 40.2,42.34 40.1,42.24 40,42.24 39.9,42.14 38.8,42.14 38.7,42.24 38.6,42.24 38.5,42.34 29.64,42.34 29.12,41.82 29.12,41.56 20.7,33.14 19.9,33.14 19.8,33.04 v19.6,33.04 | v17.2,33.04 15.6,33.04 15.5,33.14 v14.5,33.14
LED_16  (via drill 0.35)
  Top 0.2: v29.8,38.94 41.4,38.94 46.6,44.14 46.6,44.84 52.4,50.64 56,50.64 61.7,56.34 61.8,56.34 OUT_LED_R3.2 | v21.1,30.54 21,30.64 19.7,30.64 19.6,30.54 v17.2,30.54 | v15.2,32.44 13.6,32.44 5.3,24.14 5.1,24.14 U$2.23/A9
  Bottom 0.2: v29.8,38.94 29.5,38.94 v21.1,30.54 | v17.2,30.54 15.3,32.44 v15.2,32.44
N$2  (via drill 0.35)
  Top 0.2: v14.7,62.14 13.6,62.14 R8.2
  Bottom 0.2: v14.7,62.14 20,62.14 22.4,59.74 22.8,59.74 J2_FD.1
N$5  (via drill 0.35)
  Top 0.2: v39.5,62.34 39.7,62.54 39.7,63.44 R5.2
  Bottom 0.2: v39.5,62.34 47.9,62.34 50.5,59.74 50.8,59.74 J3_2.1
N$6
  Top 0.2: OUT_LED_R3.1 59.4,57.24 59.4,58.34 60.8,59.74 61.2,59.74 64.3,62.84 64.3,63.64 65.4,64.74 65.4,65.84 65.6,66.04 OUT_LED_3.1
N$7
  Top 0.2: OUT_LED_R4.1 54.3,57.14 55,57.14 56.6,55.54 60.3,55.54 61.3,56.54 61.3,58.44 65.1,62.24 65.6,62.24 OUT_LED_4.1
SWITCH_01  (via drill 0.35)
  Top 0.2: v54.9,70.34 55.6,71.04 55.9,71.04 J1.6 | v47.1,53.34 37.3,53.34 29.8,45.84 v29.8,41.54
  Bottom 0.2: v54.9,70.34 54.9,66.74 57.7,63.94 57.7,63.04 48,53.34 v47.1,53.34 | v29.8,41.54 20.8,32.54 20.8,32.44 20.4,32.04 20.4,31.84 U$2.5
SWITCH_02  (via drill 0.35)
  Top 0.2: v23.4,56.64 24.5,57.74 24.5,61.14 33.8,70.44 37.3,70.44 37.5,70.24 43.2,70.24 43.8,70.84 47.1,70.84 48.3,69.64 56.7,69.64 57,69.94 57,71.04 J1.5
  Bottom 0.2: 17.8,42.14 17.8,41.94 U$2.33 18.7,42.83 18.7,43.21 18.86,43.37 | 19.05,43.56 18.86,43.37 | v23.4,56.64 23.4,56.61 24,56.01 24,46.99 23.56,46.99 22.29,45.72 20.12,45.72 19.28,44.88 19.28,43.79 18.86,43.37
VCC_5V
  Top 0.35: CONN01.11 26.6,7.64 26,7.64 25.2,8.44 13.2,8.44 5.5,16.14 5.4,16.14 5.1,16.44 U$2.VIN 5,16.64 3.5,18.14 3.5,52.94 7.2,56.64 7.2,56.74 | 7.2,56.74 10,56.74 10.4,57.14 11.8,57.14 C4.1 11.9,57.04 11.9,56.34 12.4,55.84 26,55.84 29.3,59.14 30.3,59.14 MCP2562.VDD 30.4,59.14 31.4,59.14 31.9,59.64 31.9,59.94 34.7,62.74 36.6,62.74 38.4,60.94 39.7,60.94 C10.1 39.8,61.14 40,61.34 40,61.74 40.5,62.24 40.8,62.24 40.9,62.34 41.7,62.34 41.8,62.24 42.4,62.24 44.1,63.94 51.5,63.94 54.8,60.64 59.7,60.64 59.9,60.84 59.9,62.14 J4.2 | 7.2,56.74 4.8,59.14 4.5,59.14 4.4,59.04 3.8,59.04 MCP2562FD.VDD
  Bottom 0.35: CONN03.11 46.9,7.64 46.6,7.64 44.9,9.34 28.2,9.34 26.7,7.84 26.7,7.64 CONN01.11

### Text on the board
tPlace: FD | SERVER | H | H | H | L | H | L | - | - | FD | CAN2 | GND | GND | GND
bPlace: -
tNames: i2c